# Altium schematic sheet sheet2.SchDoc
size A4; SheetNumber: 2; SheetTotal: 2
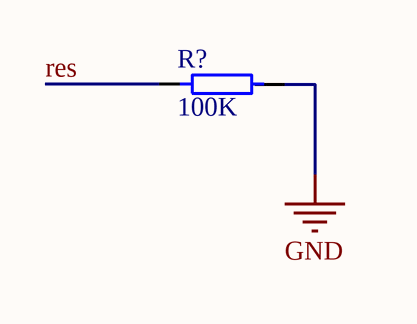
[diagram p0: sheet2.SchDoc]

## Parts
R?  100K  [SMD 0.566 0.54]

## Nets
GND: R?.2
res: R?.1

## Library data of the parts
R? = RES 100K: SMD